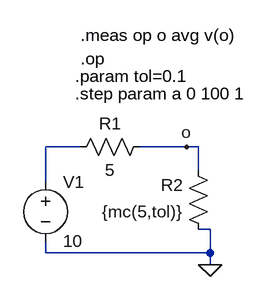
[diagram p0: schematic Draft6.asc]
Draft6.asc, the LTspice schematic file:
Version 4
SHEET 1 880 680
WIRE 208 112 160 112
WIRE 352 112 288 112
WIRE 368 112 352 112
WIRE 368 144 368 112
WIRE 160 160 160 112
WIRE 384 224 368 224
WIRE 160 256 160 240
WIRE 384 256 384 224
WIRE 384 256 160 256
WIRE 384 272 384 256
FLAG 384 272 0
FLAG 352 112 o
SYMBOL voltage 160 144 R0
WINDOW 123 0 0 Left 0
WINDOW 39 0 0 Left 0
SYMATTR InstName V1
SYMATTR Value 10
SYMBOL res 304 96 R90
WINDOW 0 0 56 VBottom 2
WINDOW 3 32 56 VTop 2
SYMATTR InstName R1
SYMATTR Value 5
SYMBOL res 384 240 R180
WINDOW 0 36 76 Left 2
WINDOW 3 36 40 Left 2
SYMATTR InstName R2
SYMATTR Value {mc(5,tol)}
TEXT 200 16 Left 2 !.param tol=0.1
TEXT 208 -8 Left 2 !.op
TEXT 200 40 Left 2 !.step param a 0 100 1
TEXT 208 -40 Left 2 !.meas op o avg v(o)

The netlist it stands for:
* Draft6.asc
V1 N001 0 10
R1 o N001 5
R2 0 o {mc(5,tol)}
.param tol=0.1
.op
.step param a 0 100 1
.meas op o avg v(o)
.backanno
.end